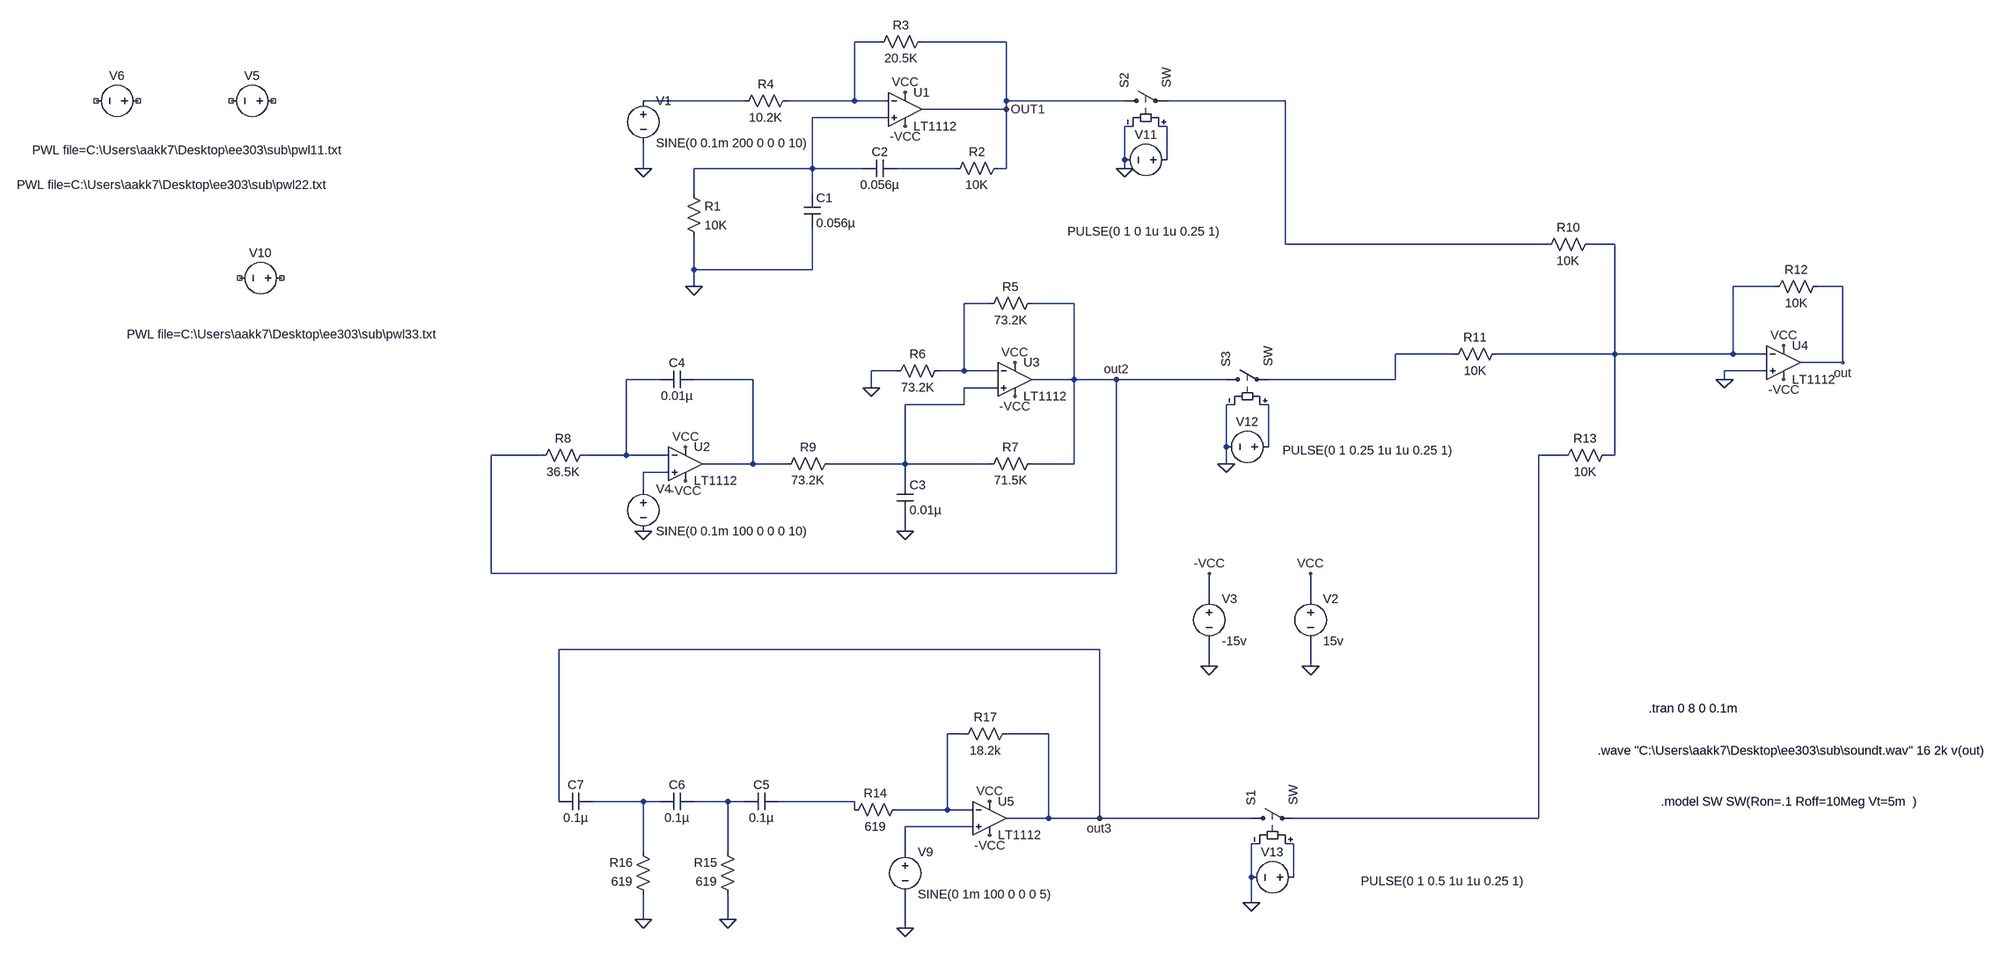
[diagram p0: schematic simulation code.asc]
simulation code.asc, the LTspice schematic file:
Version 4
SHEET 1 2536 2336
WIRE 304 -48 256 -48
WIRE 544 -48 384 -48
WIRE 48 64 -144 64
WIRE 256 64 256 -48
WIRE 256 64 128 64
WIRE 320 64 256 64
WIRE 544 64 544 -48
WIRE 768 64 544 64
WIRE 1072 64 848 64
WIRE 544 80 544 64
WIRE 544 80 384 80
WIRE 320 96 176 96
WIRE 784 112 768 112
WIRE 848 112 832 112
WIRE 768 176 768 112
WIRE 848 176 848 112
WIRE -144 192 -144 144
WIRE 176 192 176 96
WIRE 176 192 -48 192
WIRE 272 192 176 192
WIRE 448 192 336 192
WIRE 544 192 544 80
WIRE 544 192 528 192
WIRE 768 192 768 176
WIRE -48 240 -48 192
WIRE 176 240 176 192
WIRE 1072 336 1072 64
WIRE 1568 336 1072 336
WIRE 1696 336 1648 336
WIRE -48 384 -48 320
WIRE 176 384 176 304
WIRE 176 384 -48 384
WIRE -48 416 -48 384
WIRE 2000 416 1920 416
WIRE 2128 416 2080 416
WIRE 512 448 464 448
WIRE 672 448 592 448
WIRE 1392 544 1280 544
WIRE 1696 544 1696 336
WIRE 1696 544 1472 544
WIRE 1920 544 1920 416
WIRE 1920 544 1696 544
WIRE 1984 544 1920 544
WIRE 2128 560 2128 416
WIRE 2128 560 2048 560
WIRE 336 576 288 576
WIRE 464 576 464 448
WIRE 464 576 416 576
WIRE 528 576 464 576
WIRE 1984 576 1904 576
WIRE -112 592 -176 592
WIRE 64 592 -48 592
WIRE 672 592 672 448
WIRE 672 592 592 592
WIRE 752 592 672 592
WIRE 960 592 752 592
WIRE 1280 592 1280 544
WIRE 1280 592 1040 592
WIRE 1904 592 1904 576
WIRE 288 608 288 576
WIRE 528 608 464 608
WIRE 464 640 464 608
WIRE 464 640 352 640
WIRE 976 640 960 640
WIRE 1040 640 1024 640
WIRE 960 720 960 640
WIRE 1040 720 1040 640
WIRE -336 736 -432 736
WIRE -176 736 -176 592
WIRE -176 736 -256 736
WIRE -96 736 -176 736
WIRE 1600 736 1552 736
WIRE 1696 736 1696 544
WIRE 1696 736 1680 736
WIRE 64 752 64 592
WIRE 64 752 -32 752
WIRE 128 752 64 752
WIRE 352 752 352 640
WIRE 352 752 208 752
WIRE 512 752 352 752
WIRE 672 752 672 592
WIRE 672 752 592 752
WIRE 960 752 960 720
WIRE -96 768 -144 768
WIRE 352 784 352 752
WIRE -144 800 -144 768
WIRE 352 880 352 848
WIRE -432 960 -432 736
WIRE 752 960 752 592
WIRE 752 960 -432 960
WIRE 928 1008 928 960
WIRE 1120 1008 1120 960
WIRE 720 1104 -304 1104
WIRE 928 1136 928 1088
WIRE 1120 1136 1120 1088
WIRE 464 1264 432 1264
WIRE 624 1264 544 1264
WIRE -304 1392 -304 1104
WIRE -144 1392 -240 1392
WIRE -112 1392 -144 1392
WIRE 16 1392 -48 1392
WIRE 48 1392 16 1392
WIRE 256 1392 112 1392
WIRE 256 1408 256 1392
WIRE 432 1408 432 1264
WIRE 432 1408 336 1408
WIRE 480 1408 432 1408
WIRE 624 1424 624 1264
WIRE 624 1424 544 1424
WIRE 720 1424 720 1104
WIRE 720 1424 624 1424
WIRE 1008 1424 720 1424
WIRE 1552 1424 1552 736
WIRE 1552 1424 1088 1424
WIRE 480 1440 352 1440
WIRE 1024 1472 1008 1472
WIRE 1088 1472 1072 1472
WIRE -144 1488 -144 1392
WIRE 16 1488 16 1392
WIRE 352 1488 352 1440
WIRE 1008 1536 1008 1472
WIRE 1088 1536 1088 1472
WIRE 1008 1584 1008 1536
WIRE -144 1616 -144 1568
WIRE 16 1616 16 1568
WIRE 352 1632 352 1568
FLAG -48 416 0
FLAG -144 192 0
FLAG 352 48 VCC
FLAG 352 112 -VCC
FLAG 544 80 OUT1
FLAG 1120 1136 0
FLAG 928 1136 0
FLAG 1120 960 VCC
FLAG 928 960 -VCC
FLAG -64 720 VCC
FLAG -64 784 -VCC
FLAG 560 560 VCC
FLAG 560 624 -VCC
FLAG 352 880 0
FLAG 288 608 0
FLAG 752 592 out2
FLAG -144 880 0
FLAG 2128 560 out
FLAG 768 192 0
FLAG 960 752 0
FLAG 2016 528 VCC
FLAG 2016 592 -VCC
FLAG 1904 592 0
FLAG 720 1424 out3
FLAG 352 1632 0
FLAG 16 1616 0
FLAG -144 1616 0
FLAG 1008 1584 0
FLAG 512 1392 VCC
FLAG 512 1456 -VCC
SYMBOL cap 160 240 R0
SYMATTR InstName C1
SYMATTR Value 0.056µ
SYMATTR SpiceLine V=4 Irms=906m Rser=0.0609459 Lser=0 mfg="KEMET" pn="C0402C563K7PAC" type="X5R"
SYMBOL cap 336 176 R90
WINDOW 0 0 32 VBottom 2
WINDOW 3 32 32 VTop 2
SYMATTR InstName C2
SYMATTR Value 0.056µ
SYMATTR SpiceLine V=4 Irms=906m Rser=0.0609459 Lser=0 mfg="KEMET" pn="C0402C563K7PAC" type="X5R"
SYMBOL res -64 224 R0
SYMATTR InstName R1
SYMATTR Value 10K
SYMATTR SpiceLine tol=1 pwr=0.1
SYMBOL res 544 176 R90
WINDOW 0 0 56 VBottom 2
WINDOW 3 32 56 VTop 2
SYMATTR InstName R2
SYMATTR Value 10K
SYMATTR SpiceLine tol=1 pwr=0.1
SYMBOL OpAmps\\LT1112 352 16 R0
SYMATTR InstName U1
SYMBOL res 400 -64 R90
WINDOW 0 0 56 VBottom 2
WINDOW 3 32 56 VTop 2
SYMATTR InstName R3
SYMATTR Value 20.5K
SYMATTR SpiceLine tol=1 pwr=0.1
SYMBOL res 144 48 R90
WINDOW 0 0 56 VBottom 2
WINDOW 3 32 56 VTop 2
SYMATTR InstName R4
SYMATTR Value 10.2K
SYMATTR SpiceLine tol=1 pwr=0.1
SYMBOL voltage -144 48 R0
WINDOW 123 0 0 Left 0
WINDOW 39 0 0 Left 0
SYMATTR InstName V1
SYMATTR Value SINE(0 0.1m 200 0 0 0 10)
SYMBOL voltage 1120 992 R0
WINDOW 123 0 0 Left 0
WINDOW 39 0 0 Left 0
SYMATTR InstName V2
SYMATTR Value 15v
SYMBOL voltage 928 992 R0
WINDOW 123 0 0 Left 0
WINDOW 39 0 0 Left 0
SYMATTR InstName V3
SYMATTR Value -15v
SYMBOL OpAmps\\LT1112 -64 688 R0
SYMATTR InstName U2
SYMBOL OpAmps\\LT1112 560 528 R0
SYMATTR InstName U3
SYMBOL res 608 432 R90
WINDOW 0 0 56 VBottom 2
WINDOW 3 32 56 VTop 2
SYMATTR InstName R5
SYMATTR Value 73.2K
SYMATTR SpiceLine tol=1 pwr=0.1
SYMBOL res 432 560 R90
WINDOW 0 0 56 VBottom 2
WINDOW 3 32 56 VTop 2
SYMATTR InstName R6
SYMATTR Value 73.2K
SYMATTR SpiceLine tol=1 pwr=0.1
SYMBOL res 608 736 R90
WINDOW 0 0 56 VBottom 2
WINDOW 3 32 56 VTop 2
SYMATTR InstName R7
SYMATTR Value 71.5K
SYMATTR SpiceLine tol=1 pwr=0.1
SYMBOL cap 336 784 R0
SYMATTR InstName C3
SYMATTR Value 0.01µ
SYMATTR SpiceLine V=6.3 Irms=0 Rser=0 Lser=0 mfg="Murata" pn="GRM033R70J103KA01" type="X7R"
SYMBOL cap -48 576 R90
WINDOW 0 0 32 VBottom 2
WINDOW 3 32 32 VTop 2
SYMATTR InstName C4
SYMATTR Value 0.01µ
SYMATTR SpiceLine V=6.3 Irms=0 Rser=0 Lser=0 mfg="Murata" pn="GRM033R70J103KA01" type="X7R"
SYMBOL res -240 720 R90
WINDOW 0 0 56 VBottom 2
WINDOW 3 32 56 VTop 2
SYMATTR InstName R8
SYMATTR Value 36.5K
SYMATTR SpiceLine tol=1 pwr=0.1
SYMBOL res 224 736 R90
WINDOW 0 0 56 VBottom 2
WINDOW 3 32 56 VTop 2
SYMATTR InstName R9
SYMATTR Value 73.2K
SYMATTR SpiceLine tol=1 pwr=0.1
SYMBOL voltage -144 784 R0
WINDOW 123 0 0 Left 0
WINDOW 39 0 0 Left 0
SYMATTR InstName V4
SYMATTR Value SINE(0 0.1m 100 0 0 0 10)
SYMBOL voltage -2112 64 R90
WINDOW 0 -32 56 VBottom 2
WINDOW 3 78 180 VTop 2
WINDOW 123 0 0 Left 0
WINDOW 39 0 0 Left 0
SYMATTR InstName V5
SYMATTR Value PWL file=C:\Users\aakk7\Desktop\ee303\sub\pwl11.txt
SYMBOL voltage -2368 64 R90
WINDOW 0 -32 56 VBottom 2
WINDOW 3 144 -47 VTop 2
WINDOW 123 0 0 Left 0
WINDOW 39 0 0 Left 0
SYMATTR InstName V6
SYMATTR Value PWL file=C:\Users\aakk7\Desktop\ee303\sub\pwl22.txt
SYMBOL res 1664 320 R90
WINDOW 0 0 56 VBottom 2
WINDOW 3 32 56 VTop 2
SYMATTR InstName R10
SYMATTR Value 10K
SYMATTR SpiceLine tol=1 pwr=0.1
SYMBOL res 1488 528 R90
WINDOW 0 0 56 VBottom 2
WINDOW 3 32 56 VTop 2
SYMATTR InstName R11
SYMATTR Value 10K
SYMATTR SpiceLine tol=1 pwr=0.1
SYMBOL OpAmps\\LT1112 2016 496 R0
SYMATTR InstName U4
SYMBOL sw 752 64 R270
SYMATTR InstName S2
SYMBOL sw 944 592 R270
SYMATTR InstName S3
SYMBOL res 2096 400 R90
WINDOW 0 0 56 VBottom 2
WINDOW 3 32 56 VTop 2
SYMATTR InstName R12
SYMATTR Value 10K
SYMATTR SpiceLine tol=1 pwr=0.1
SYMBOL res 1696 720 R90
WINDOW 0 0 56 VBottom 2
WINDOW 3 32 56 VTop 2
SYMATTR InstName R13
SYMATTR Value 10K
SYMATTR SpiceLine tol=1 pwr=0.1
SYMBOL res 352 1392 R90
WINDOW 0 0 56 VBottom 2
WINDOW 3 32 56 VTop 2
SYMATTR InstName R14
SYMATTR Value 619
SYMATTR SpiceLine tol=1 pwr=0.1
SYMBOL res 32 1584 R180
WINDOW 0 36 76 Left 2
WINDOW 3 36 40 Left 2
SYMATTR InstName R15
SYMATTR Value 619
SYMATTR SpiceLine tol=1 pwr=0.1
SYMBOL res -128 1584 R180
WINDOW 0 36 76 Left 2
WINDOW 3 36 40 Left 2
SYMATTR InstName R16
SYMATTR Value 619
SYMATTR SpiceLine tol=1 pwr=0.1
SYMBOL res 448 1280 R270
WINDOW 0 32 56 VTop 2
WINDOW 3 0 56 VBottom 2
SYMATTR InstName R17
SYMATTR Value 18.2k
SYMATTR SpiceLine tol=1 pwr=0.1
SYMBOL cap 112 1376 R90
WINDOW 0 0 32 VBottom 2
WINDOW 3 32 32 VTop 2
SYMATTR InstName C5
SYMATTR Value 0.1µ
SYMATTR SpiceLine V=4 Irms=1.62 Rser=0.0464862 Lser=0 mfg="KEMET" pn="C0402C104K7PAC" type="X5R"
SYMBOL cap -48 1376 R90
WINDOW 0 0 32 VBottom 2
WINDOW 3 32 32 VTop 2
SYMATTR InstName C6
SYMATTR Value 0.1µ
SYMATTR SpiceLine V=4 Irms=1.62 Rser=0.0464862 Lser=0 mfg="KEMET" pn="C0402C104K7PAC" type="X5R"
SYMBOL cap -240 1376 R90
WINDOW 0 0 32 VBottom 2
WINDOW 3 32 32 VTop 2
SYMATTR InstName C7
SYMATTR Value 0.1µ
SYMATTR SpiceLine V=4 Irms=1.62 Rser=0.0464862 Lser=0 mfg="KEMET" pn="C0402C104K7PAC" type="X5R"
SYMBOL Opamps\\LT1112 512 1360 R0
SYMATTR InstName U5
SYMBOL voltage 352 1472 R0
WINDOW 123 0 0 Left 0
WINDOW 39 0 0 Left 0
SYMATTR InstName V9
SYMATTR Value SINE(0 1m 100 0 0 0 5)
SYMBOL voltage -2096 400 R90
WINDOW 0 -32 56 VBottom 2
WINDOW 3 91 17 VTop 2
WINDOW 123 0 0 Left 0
WINDOW 39 0 0 Left 0
SYMATTR InstName V10
SYMATTR Value PWL file=C:\Users\aakk7\Desktop\ee303\sub\pwl33.txt
SYMBOL sw 992 1424 R270
SYMATTR InstName S1
SYMBOL voltage 864 176 R90
WINDOW 0 -32 56 VBottom 2
WINDOW 3 120 59 VTop 2
WINDOW 123 0 0 Left 0
WINDOW 39 0 0 Left 0
SYMATTR InstName V11
SYMATTR Value PULSE(0 1 0 1u 1u 0.25 1)
SYMBOL voltage 1056 720 R90
WINDOW 0 -32 56 VBottom 2
WINDOW 3 -9 -173 VTop 2
WINDOW 123 0 0 Left 0
WINDOW 39 0 0 Left 0
SYMATTR InstName V12
SYMATTR Value PULSE(0 1 0.25 1u 1u 0.25 1)
SYMBOL voltage 1104 1536 R90
WINDOW 0 -32 56 VBottom 2
WINDOW 3 -8 -267 VTop 2
WINDOW 123 0 0 Left 0
WINDOW 39 0 0 Left 0
SYMATTR InstName V13
SYMATTR Value PULSE(0 1 0.5 1u 1u 0.25 1)
TEXT 1784 1392 Left 2 !.model SW SW(Ron=.1 Roff=10Meg Vt=5m  )
TEXT 1664 1296 Left 2 !.wave "C:\\Users\\aakk7\\Desktop\\ee303\\sub\\soundt.wav" 16 2k v(out)
TEXT 1760 1216 Left 2 !.tran 0 8 0 0.1m

The netlist it stands for:
* simulation code.asc
C1 N004 0 0.056µ V=4 Irms=906m Rser=0.0609459 Lser=0 mfg="KEMET" pn="C0402C563K7PAC" type="X5R"
C2 N006 N004 0.056µ V=4 Irms=906m Rser=0.0609459 Lser=0 mfg="KEMET" pn="C0402C563K7PAC" type="X5R"
R1 N004 0 10K tol=1 pwr=0.1
R2 OUT1 N006 10K tol=1 pwr=0.1
XU1 N004 N001 VCC -VCC OUT1 LT1112  ; pins In+ In- V+ V- OUT
R3 OUT1 N001 20.5K tol=1 pwr=0.1
R4 N001 N002 10.2K tol=1 pwr=0.1
V1 N002 0 SINE(0 0.1m 200 0 0 0 10)
V2 VCC 0 15v
V3 -VCC 0 -15v
XU2 N015 N010 VCC -VCC N011 LT1112  ; pins In+ In- V+ V- OUT
XU3 N012 N008 VCC -VCC out2 LT1112  ; pins In+ In- V+ V- OUT
R5 out2 N008 73.2K tol=1 pwr=0.1
R6 N008 0 73.2K tol=1 pwr=0.1
R7 out2 N012 71.5K tol=1 pwr=0.1
C3 N012 0 0.01µ V=6.3 Irms=0 Rser=0 Lser=0 mfg="Murata" pn="GRM033R70J103KA01" type="X7R"
C4 N011 N010 0.01µ V=6.3 Irms=0 Rser=0 Lser=0 mfg="Murata" pn="GRM033R70J103KA01" type="X7R"
R8 N010 out2 36.5K tol=1 pwr=0.1
R9 N012 N011 73.2K tol=1 pwr=0.1
V4 N015 0 SINE(0 0.1m 100 0 0 0 10)
V5 NC_01 NC_02 PWL file=C:\Users\aakk7\Desktop\ee303\sub\pwl11.txt
V6 NC_03 NC_04 PWL file=C:\Users\aakk7\Desktop\ee303\sub\pwl22.txt
R10 N007 N003 10K tol=1 pwr=0.1
R11 N007 N009 10K tol=1 pwr=0.1
XU4 0 N007 VCC -VCC out LT1112  ; pins In+ In- V+ V- OUT
S2 OUT1 N003 N005 0 SW
S3 out2 N009 N013 0 SW
R12 out N007 10K tol=1 pwr=0.1
R13 N007 N014 10K tol=1 pwr=0.1
R14 N016 N019 619 tol=1 pwr=0.1
R15 0 N018 619 tol=1 pwr=0.1
R16 0 N017 619 tol=1 pwr=0.1
R17 N016 out3 18.2k tol=1 pwr=0.1
C5 N019 N018 0.1µ V=4 Irms=1.62 Rser=0.0464862 Lser=0 mfg="KEMET" pn="C0402C104K7PAC" type="X5R"
C6 N018 N017 0.1µ V=4 Irms=1.62 Rser=0.0464862 Lser=0 mfg="KEMET" pn="C0402C104K7PAC" type="X5R"
C7 N017 out3 0.1µ V=4 Irms=1.62 Rser=0.0464862 Lser=0 mfg="KEMET" pn="C0402C104K7PAC" type="X5R"
XU5 N020 N016 VCC -VCC out3 LT1112  ; pins In+ In- V+ V- OUT
V9 N020 0 SINE(0 1m 100 0 0 0 5)
V10 NC_05 NC_06 PWL file=C:\Users\aakk7\Desktop\ee303\sub\pwl33.txt
S1 out3 N014 N021 0 SW
V11 N005 0 PULSE(0 1 0 1u 1u 0.25 1)
V12 N013 0 PULSE(0 1 0.25 1u 1u 0.25 1)
V13 N021 0 PULSE(0 1 0.5 1u 1u 0.25 1)
.model SW SW(Ron=.1 Roff=10Meg Vt=5m  )
.wave "C:\Users\aakk7\Desktop\ee303\sub\soundt.wav" 16 2k v(out)
.tran 0 8 0 0.1m
.lib LTC.lib
.backanno
.end